# EAGLE design Breys RTC module (EAGLE 6.2)
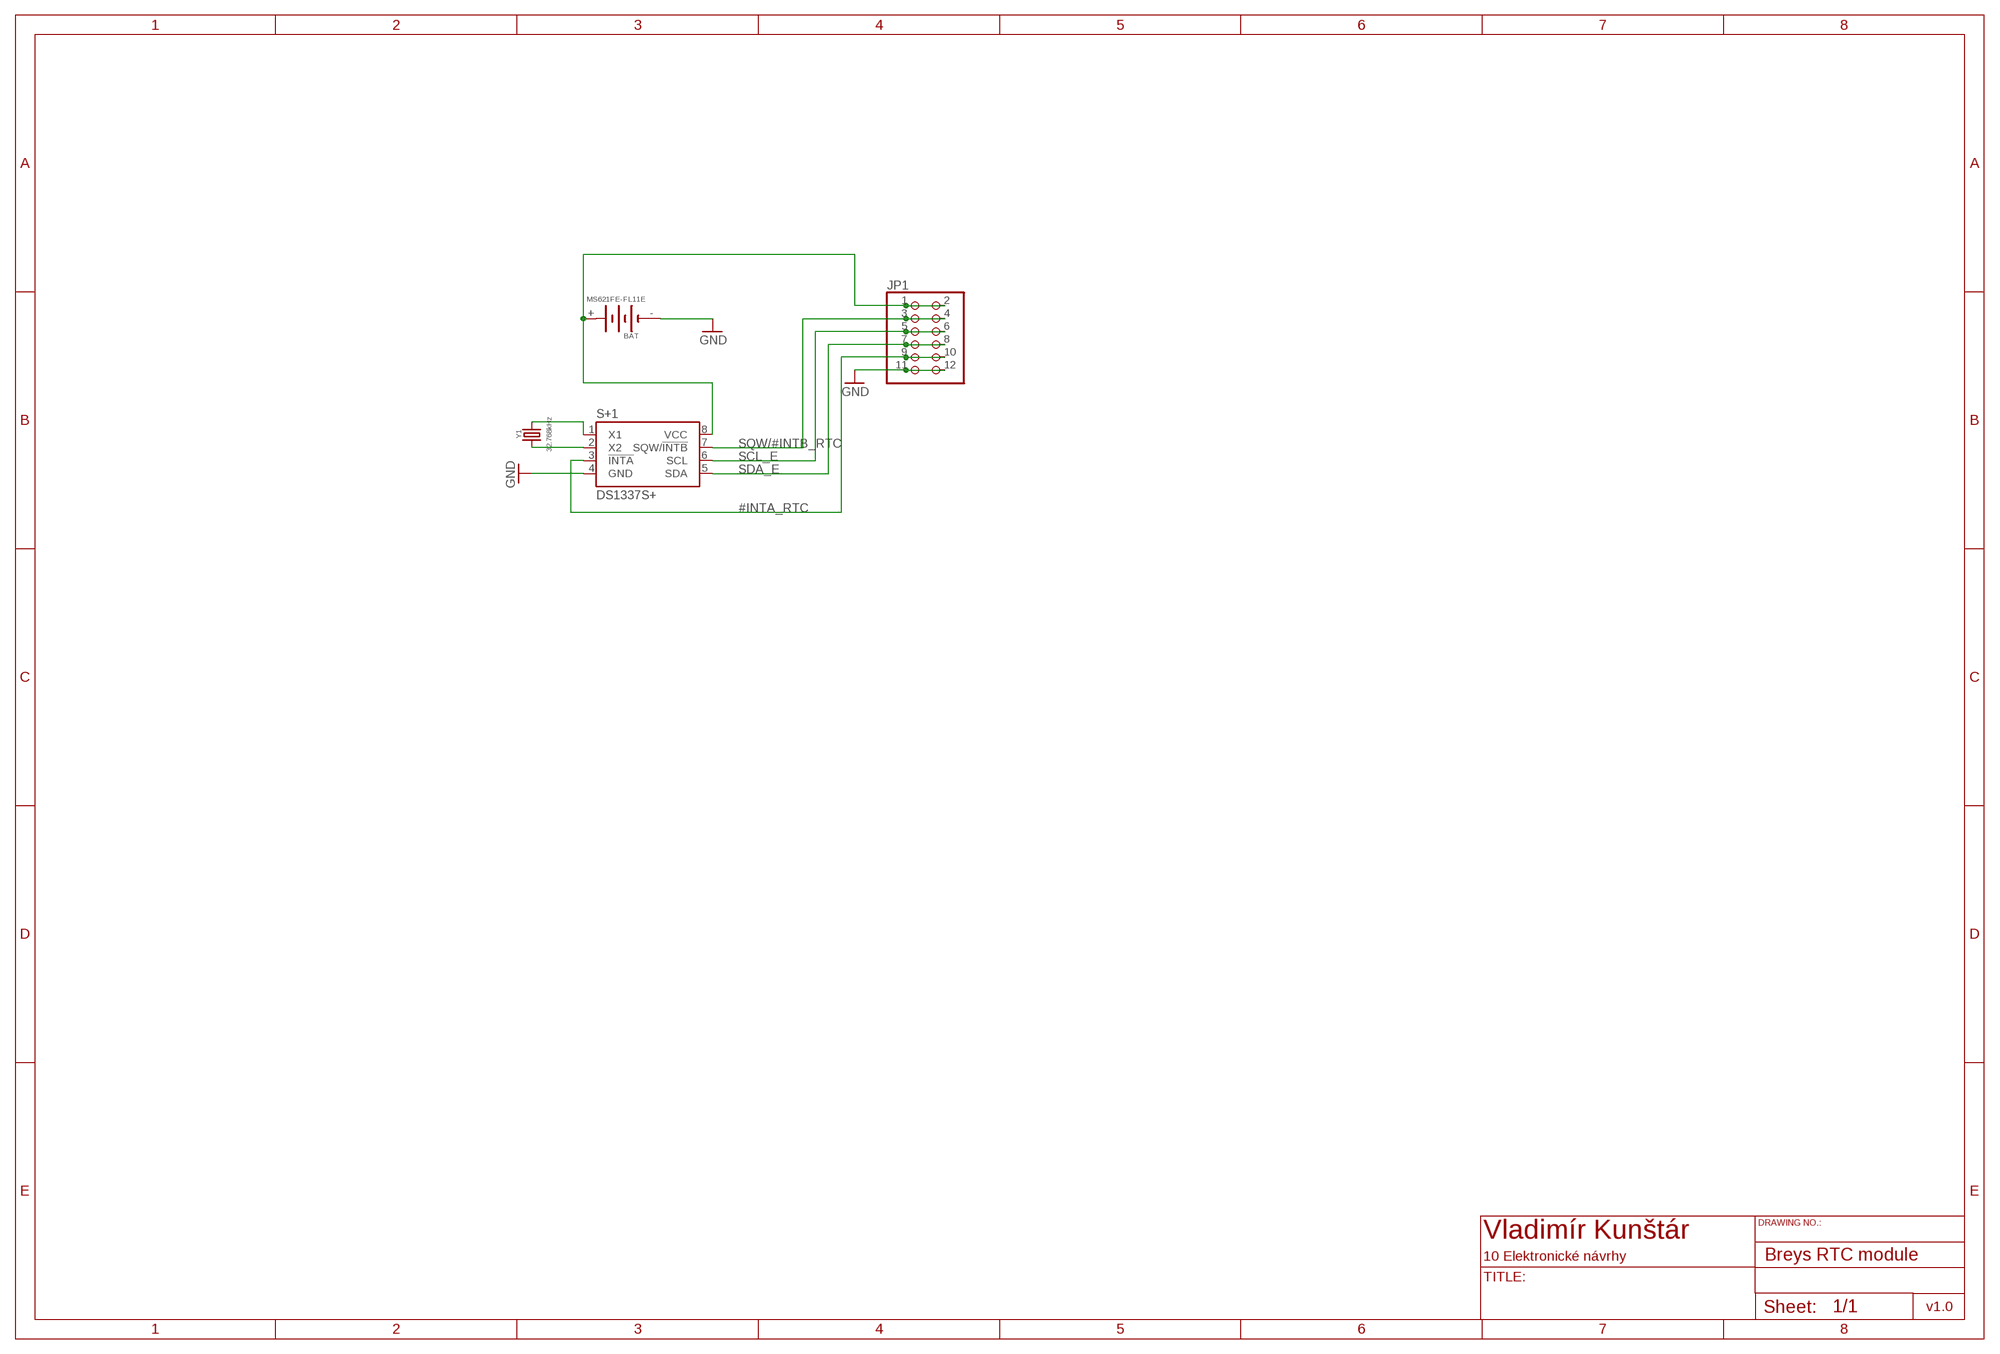
[diagram p0: schematic, sheet 1]

## Parts
BAT  MS621FE-FL11E  [MS621FEFL11E]
JP1  PINHD-2X6  [2X06]
S+1  DS1337S+  [SO8]
Y1  32.768kHz  CFPX–217  [CFPX–217]

## Nets
#INTA_RTC: JP1.9 JP1.10 S+1.3(!INTA)
GND: BAT.- JP1.11 JP1.12 S+1.4(GND)
N$1: BAT.+ JP1.1 JP1.2 S+1.8(VCC)
N$34: S+1.2(X2) Y1.2
N$42: S+1.1(X1) Y1.1
SCL_E: JP1.5 JP1.6 S+1.6(SCL)
SDA_E: JP1.7 JP1.8 S+1.5(SDA)
SQW/#INTB_RTC: JP1.3 JP1.4 S+1.7(SQW/!INTB!)

## Notes on the sheet
- DRAWING NO.:
- Vladimír Kunštár
- 10 Elektronické návrhy
- TITLE:
- v1.0

## Library data of the parts
BAT = Battery:MS621FE-FL11E; FARNELL: 1614634
JP1 = pinhead:PINHD-2X6: PIN HEADER
S+1 = AjRTC:DS1337: DS1337 I2C serial real-time clock Low-power clock/calendar with two programmable time-of-day alarms and a programmable square-wave output. http://pdfserv.maxim-ic.com/en/ds/DS1337-DS1337C.pdf
Y1 = Crystals:CFPX–217; TME: CFPX-217

## Board
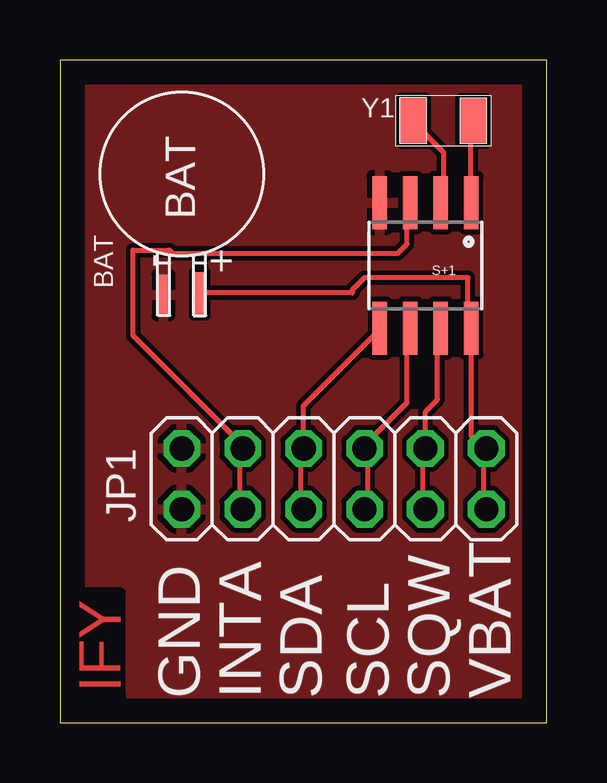
[diagram p1: board, top side]
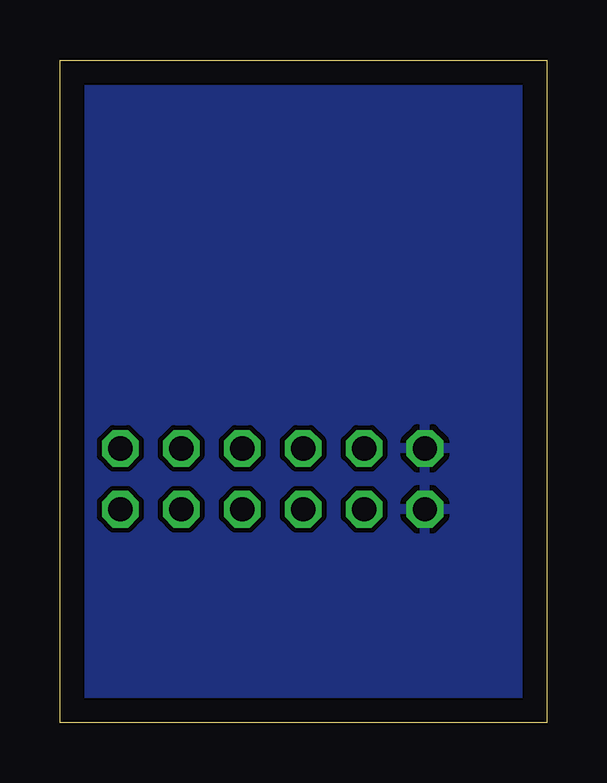
[diagram p2: board, bottom side, seen from below]

Size 20.3 x 27.61 mm. Coordinates in mm from the lower left corner, seen from the top.
Outline: 0,0 20.3,0 20.3,27.61 0,27.61 0,0
Copper layers (1*16): Top 0.035mm / dielectric 1.5mm / Bottom 0.035mm
Design rules: minimum track width 8mil, minimum drill 24mil, track to track 8mil, track to pad 8mil, pad to pad 8mil, via to via 8mil, smd to smd 8mil, copper to edge 40mil, drill to drill 8mil, minimum pad ring 10mil, minimum via ring 8mil, stop-mask expansion 4mil, vias tented up to drill 0mil, thermal gap 10mil

### Footprints (pad centres in the part's own frame; a part is rotated, then mirrored left to right if it is on the bottom)
MS621FEFL11E = smd 1.8 x 0.5: + 4.99,0.75 | smd 1.7 x 0.5: - 5.04,-0.76
2X06 = drill 1.016 octagon: 1 -6.35,-1.27; 2 -6.35,1.27; 3 -3.81,-1.27; 4 -3.81,1.27; 5 -1.27,-1.27; 6 -1.27,1.27; 7 1.27,-1.27; 8 1.27,1.27; 9 3.81,-1.27; 10 3.81,1.27; 11 6.35,-1.27; 12 6.35,1.27
SO8 = smd 0.61 x 2.21: 1 -1.905,-2.616; 2 -0.635,-2.616; 3 0.635,-2.616; 4 1.905,-2.616; 5 1.905,2.616; 6 0.635,2.616; 7 -0.635,2.616; 8 -1.905,2.616
CFPX–217 = smd 1.1 x 1.9: 1 0.55,-0.94; 2 3.05,-0.95

### Placement (x,y rotation side)
BAT  5.08,22.86 270 top
JP1  11.43,10.16 180 top
S+1  15.24,19.05 180 top
Y1  17.78,24.13 180 top

### Tracks (layer width: path | path; a pad name or v marks a point on that pad's centre or on a via)
#INTA_RTC
  Top 0.203: S+1.3 14.61,21.59 14.48,21.46 14.48,19.94 14.1,19.56 4.7,19.56 4.57,19.68 3.05,19.68 3.05,16.13 7.62,11.56 JP1.9 7.49,11.56 7.49,9.02 JP1.10
GND
  pour Top: 0,0 0,27.94 20.32,27.94 20.32,0
  pour Bottom: 0,0 20.32,0 20.32,27.94 0,27.94
N$1
  Top 0.203: JP1.2 17.65,9.02 17.65,11.3 JP1.1 17.65,11.43 17.14,11.94 S+1.8 17.14,16.51 17.02,16.64 17.02,18.54 12.7,18.54 12.19,18.03 12.19,17.91 5.84,17.91 BAT.+
N$34
  Top 0.203: Y1.2 14.73,25.02 16,23.75 16,21.84 15.88,21.72 S+1.2
N$42
  Top 0.203: S+1.1 17.14,25.02 Y1.1
SCL_E
  Top 0.203: S+1.6 14.61,16.38 14.48,16.26 14.48,13.34 12.7,11.56 JP1.5 12.83,11.56 12.83,9.02 JP1.6
SDA_E
  Top 0.203: S+1.5 13.34,16.38 10.16,13.21 JP1.7 10.03,11.3 10.03,9.02 JP1.8
SQW/#INTB_RTC
  Top 0.203: S+1.7 15.88,16.38 15.75,16.26 15.75,13.46 15.24,12.95 JP1.3 15.11,11.3 15.11,9.02 JP1.4

### Text on the board
Top: IFY
tNames: GND | INTA | SDA | SCL | SQW | VBAT